# EAGLE design DensityAltitude (EAGLE 7.2.0)
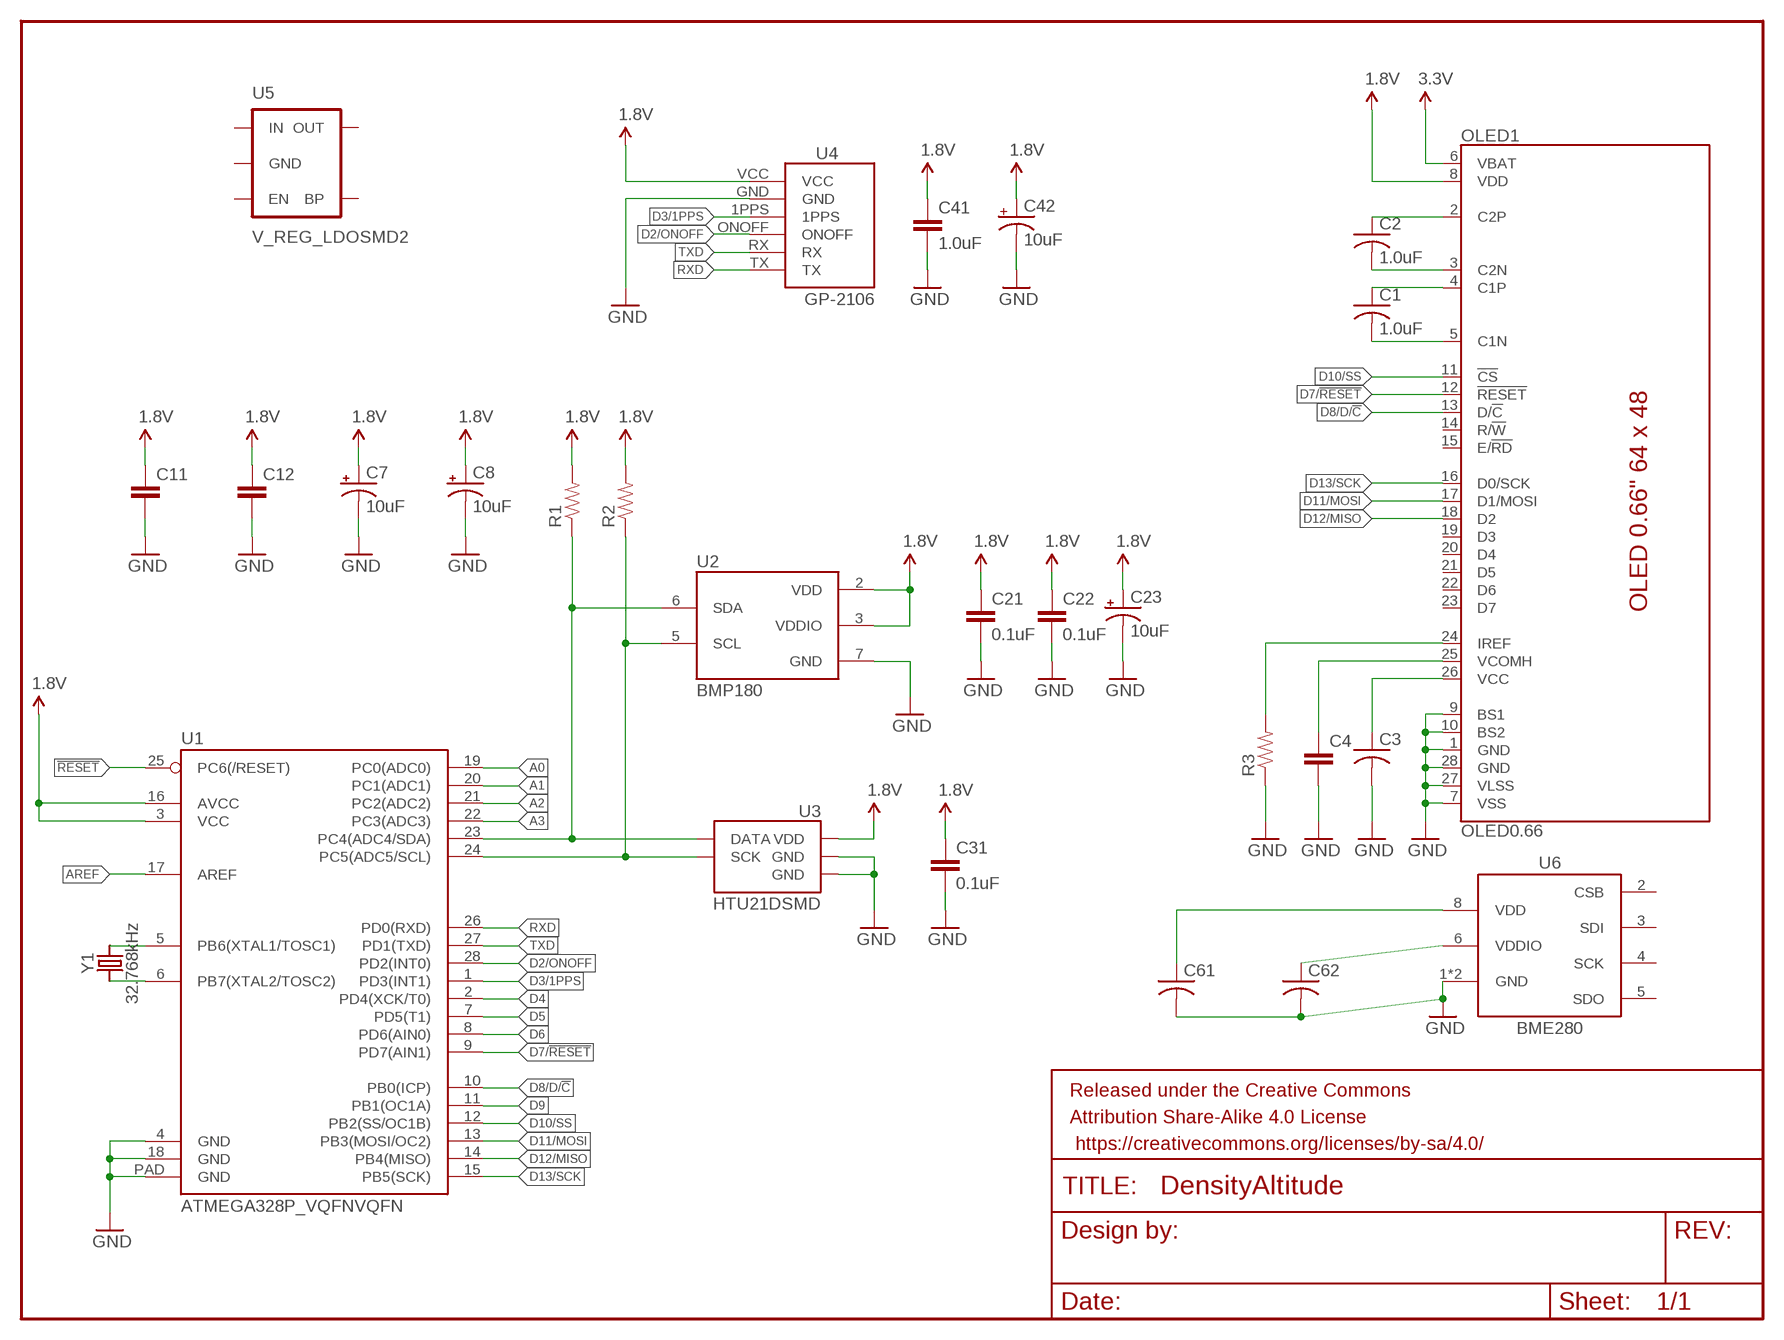
[diagram p0: schematic, sheet 1]

## Parts
C1  1.0uF  C-USC0201  [C0201]
C2  1.0uF  C-USC0201  [C0201]
C3  C-USC0201  [C0201]
C4  CAP0402-CAP  [0402-CAP]
C7  10uF  10UF-16V-10%(TANT)  [EIA3216]
C8  10uF  10UF-16V-10%(TANT)  [EIA3216]
C11  CAP0402-CAP  [0402-CAP]
C12  CAP0402-CAP  [0402-CAP]
C21  0.1uF  0.1UF-16V(+-10%)(0402)  [0402-CAP]
C22  0.1uF  0.1UF-16V(+-10%)(0402)  [0402-CAP]
C23  10uF  10UF-16V-10%(TANT)  [EIA3216]
C31  0.1uF  0.1UF-16V(+-10%)(0402)  [0402-CAP]
C41  1.0uF  1.0UF-16V-10%(0402)  [0402-CAP]
C42  10uF  10UF-16V-10%(TANT)  [EIA3216]
C61  C-USC0201  [C0201]
C62  C-USC0201  [C0201]
FRAME1  FRAME-LETTER  [CREATIVE_COMMONS]
OLED1  OLED0.66  [OLED-0.66-64X48]
R1  RESISTOR0402-RES  [0402-RES]
R2  RESISTOR0402-RES  [0402-RES]
R3  RESISTOR0402-RES  [0402-RES]
U1  ATMEGA328P_VQFNVQFN  [VQFN-28]
U2  BMP180  [BMP180]
U3  HTU21DSMD  [HTU21D]
U4  GP-2106  [GP-2106]
U5  V_REG_LDOSMD2  [SC70]
U6  BME280  [BME280]
Y1  32.768kHz  FX12232.768KHZ  [2-SMD]

## Nets
1.8V: C7.A(+) C8.A(+) C11.1 C12.1 C21.1 C22.1 C23.A(+) C31.1 C41.1 C42.A(+) OLED1.8(VDD) R1.2 R2.2 U1.3(VCC) U1.16(AVCC) U2.2(VDD) U2.3(VDDIO) U3.VDD U4.VCC
3.3V: OLED1.6(VBAT)
!RESET: U1.25(PC6(/RESET))
A0: U1.19(PC0(ADC0))
A1: U1.20(PC1(ADC1))
A2: U1.21(PC2(ADC2))
A3: U1.22(PC3(ADC3))
A4/SDA: R1.1 U1.23(PC4(ADC4/SDA)) U2.6(SDA) U3.DATA
A5/SCL: R2.1 U1.24(PC5(ADC5/SCL)) U2.5(SCL) U3.SCK
AREF: U1.17(AREF)
D2/ONOFF: U1.28(PD2(INT0)) U4.ONOFF
D3/1PPS: U1.1(PD3(INT1)) U4.1PPS
D4: U1.2(PD4(XCK/T0))
D5: U1.7(PD5(T1))
D6: U1.8(PD6(AIN0))
D7/!RESET: OLED1.12(!RESET!) U1.9(PD7(AIN1))
D8/D/!C: OLED1.13(D/!C!) U1.10(PB0(ICP))
D9: U1.11(PB1(OC1A))
D10/SS: OLED1.11(!CS!) U1.12(PB2(SS/OC1B))
D11/MOSI: OLED1.17(D1/MOSI) U1.13(PB3(MOSI/OC2))
D12/MISO: OLED1.18(D2) U1.14(PB4(MISO))
D13/SCK: OLED1.16(D0/SCK) U1.15(PB5(SCK))
GND: C3.2 C4.2 C7.C(-) C8.C(-) C11.2 C12.2 C21.2 C22.2 C23.C(-) C31.2 C41.2 C42.C(-) C61.2 C62.2 OLED1.1(GND) OLED1.7(VSS) OLED1.9(BS1) OLED1.10(BS2) OLED1.27(VLSS) OLED1.28(GND) R3.1 U1.4(GND) U1.18(GND) U1.PAD(GND) U2.7(GND) U3.7(GND) U3.GND U4.GND U6.1(GND) U6.7(GND)
N$1: C62.1 U6.6(VDDIO)
N$3: C61.1 U6.8(VDD)
N$4: U1.5(PB6(XTAL1/TOSC1)) Y1.2
N$5: U1.6(PB7(XTAL2/TOSC2)) Y1.1
N$13: C2.1 OLED1.2(C2P)
N$14: C2.2 OLED1.3(C2N)
N$15: C1.1 OLED1.4(C1P)
N$16: C1.2 OLED1.5(C1N)
N$17: C3.1 OLED1.26(VCC)
N$18: C4.1 OLED1.25(VCOMH)
N$19: OLED1.24(IREF) R3.2
RXD: U1.26(PD0(RXD)) U4.TX
TXD: U1.27(PD1(TXD)) U4.RX
Unconnected: OLED1.14(R/!W!) OLED1.15(E/!RD!) OLED1.19(D3) OLED1.20(D4) OLED1.21(D5) OLED1.22(D6) OLED1.23(D7) U5.1(IN) U5.2(GND) U5.3(EN) U5.4(BP) U5.5(OUT) U6.2(CSB) U6.3(SDI) U6.4(SCK) U6.5(SDO)

## Library data of the parts
C1-C3 C61 C62 = rcl:C-US: CAPACITOR, American symbol
C4 C11 C12 = SparkFun-Passives:CAP: Capacitor Standard 0603 ceramic capacitor, and 0.1" leaded capacitor.
C7 C8 C23 C42 = SparkFun-Capacitors:10UF-16V-10%(TANT): CAP-00811 1206/EIA-3216 Tantalum capacitor; PROD_ID: CAP-00811
C21 C22 C31 = SparkFun-Capacitors:0.1UF-16V(+-10%)(0402); PROD_ID: CAP-12416
C41 = SparkFun-Capacitors:1.0UF-16V-10%(0402); PROD_ID: CAP-12417
FRAME1 = SparkFun-Aesthetics:FRAME-LETTER: Schematic Frame Standard 8.5x11 US Letter frame; DESIGNER: NAME; VERSION: v01
OLED1 = SparkFun-Displays:OLED0.66
R1-R3 = SparkFun-Passives:RESISTOR: Resistor Basic schematic elements and footprints for 0603, 1206, and PTH resistors.
U1 = SparkFun-DigitalIC:ATMEGA328P_VQFN
U2 = SparkFun-Sensors:BMP180: BOSCH BMP180 DIGITAL BAROMETRIC PRESSURE SENSOR Web page: http://www.bosch-sensortec.com/en/homepage/products_3/environmental_sensors_1/bmp180_1/bmp180 Datasheet: http://ae-bst.resource.bosch.com/media/products/dokumente/bmp180/BST-BMP180-DS000-09.pdf The BMP180 is the function compatible successor of the BMP085, a new generation of high precision digital pressure sensors for consumer applications. The ultra-low power, low voltage electronics of the BMP180 is optimized for use in mobile phones, PDAs, GPS navigation devices and outdoor equipment. With a low altitude noise of merely 0.25m at fast conversion time, the BMP180 offers superior performance. The I2C interface allows for easy system integration with a microcontroller. The BMP180 is based on piezo-resistive technology for EMC robustness, high accuracy and linearity as well as long term stability. Key features: - Temperature measurement included - I2C interface - Fully calibrated - Pb-free, halogen-free and RoHS compliant, - MSL 1 Basic specs: Pressure range: 300 to 1100hPa (+9000m to -500m relating to sea level) Supply voltage: 1.8 to 3.6V (VDD), 1.62V to 3.6V (VDDIO) Package: LGA package with metal lid Small footprint: 3.6mm x 3.8mm Super-flat: 0.93mm height Low power: 5μA at 1 sample / sec. in standard mode Low noise: 0.06hPa (0.5m) in ultra low power mode, 0.02hPa (0.17m) advanced resolution mode Typical applications: - Enhancement of GPS navigation (dead-reckoning, slope detection, etc.) - In- and out-door navigation - Leisure and sports - Weather forecast - Vertical velocity indication (rise/sink speed)
U3 = SparkFun-Sensors:HTU21D
U4 = SparkFun-RF:GP-2106: GP-2106 GPS SiRF IV
U5 = SparkFun-PowerIC:V_REG_LDO: Voltage Regulator LDO Standard 150mA LDO voltage regulator in SOT-23 layout. Micrel part MIC5205. BP (by-pass) pin is used to lower output noise with 470pF cap.
U6 = DensityAltitude:BME280: BOSCH BME280 Combined humidity and pressure sensor Web page: http://www.bosch-sensortec.com/en/homepage/products_3/environmental_sensors_1/bme280/bme280_1 Datasheet: http://ae-bst.resource.bosch.com/media/products/dokumente/bme280/BST-BME280_DS001-09.pdf The BME280 is an integrated environmental sensor developed specifically for mobile applications where size and low power consumption are key design constraints. The unit combines individual high linearity, high accuracy sensors for pressure, humidity and temperature in an 8-pin metal-lid 2.5 x 2.5 x 0.93 mm3 LGA package, designed for low current consumption (3.6 μA @1Hz), long term stability and high EMC robustness. The humidity sensor features an extremely fast response time which supports performance requirements for emerging applications such as context awareness, and high accuracy over a wide temperature range. The pressure sensor is an absolute barometric pressure sensor with features exceptionally high accuracy and resolution at very low noise. The integrated temperature sensor has been optimized for very low noise and high resolution. It is primarily used for temperature compensation of the pressure and humidity sensors, and can also be used for estimating ambient temperature. The BME280 supports a full suite of operating modes which provides the flexibility to optimize the device for power consumption, resolution and filter performance. Key features: - Temperature measurement included - I2C and SPI interfaces - Fully calibrated - Pb-free, halogen-free and RoHS compliant, - MSL 1 Basic specs: Pressure range: 300 to 1100hPa (+9000m to -500m relating to sea level) Supply voltage: 1.71 to 3.6V (VDD), 1.2V to 3.6V (VDDIO) Package: LGA package with metal lid Small footprint: 2.5mm x 2.5mm Super-flat: 0.93mm height Low power: 3.6μA at 1 sample / sec. in standard mode (humidity, pressure and temperature) Low noise: 0.06hPa (0.5m) in ultra low power mode, 0.02hPa (0.17m) advanced resolution mode Typical applications: - Context awareness, e.g. skin detection, room change detection - Health monitoring / well-being • Warning regarding dehydration or heat stroke • Measurement of lung volume and air flow - Home automation control • Control heating, ventilation, air conditioning (HVAC) - Internet of things - GPS enhancement (e.g. time-to-first-fix improvement, dead reckoning, slope detection) - Indoor navigation (change of floor detection, elevator detection) - Outdoor navigation, leisure and sports applications - Weather forecast - Vertical velocity indication (rise/sink speed)
Y1 = fx122:FX122: FX122 - SMD 2.0 x 1.2 Tuning Fork Crystal Technical Specifications: Frequency: 32.768 kHz Frequency Tolerance @ 25ºC: ±20 PPM Frequency Stability Temperature Coefficient: -0.04 PPM / (ΔºC)^2 0.6mm Height Long Term Stability http://www.foxonline.com/pdfs/FX122.pdf; DIGIKEY: 631-1261-1-ND

## Board
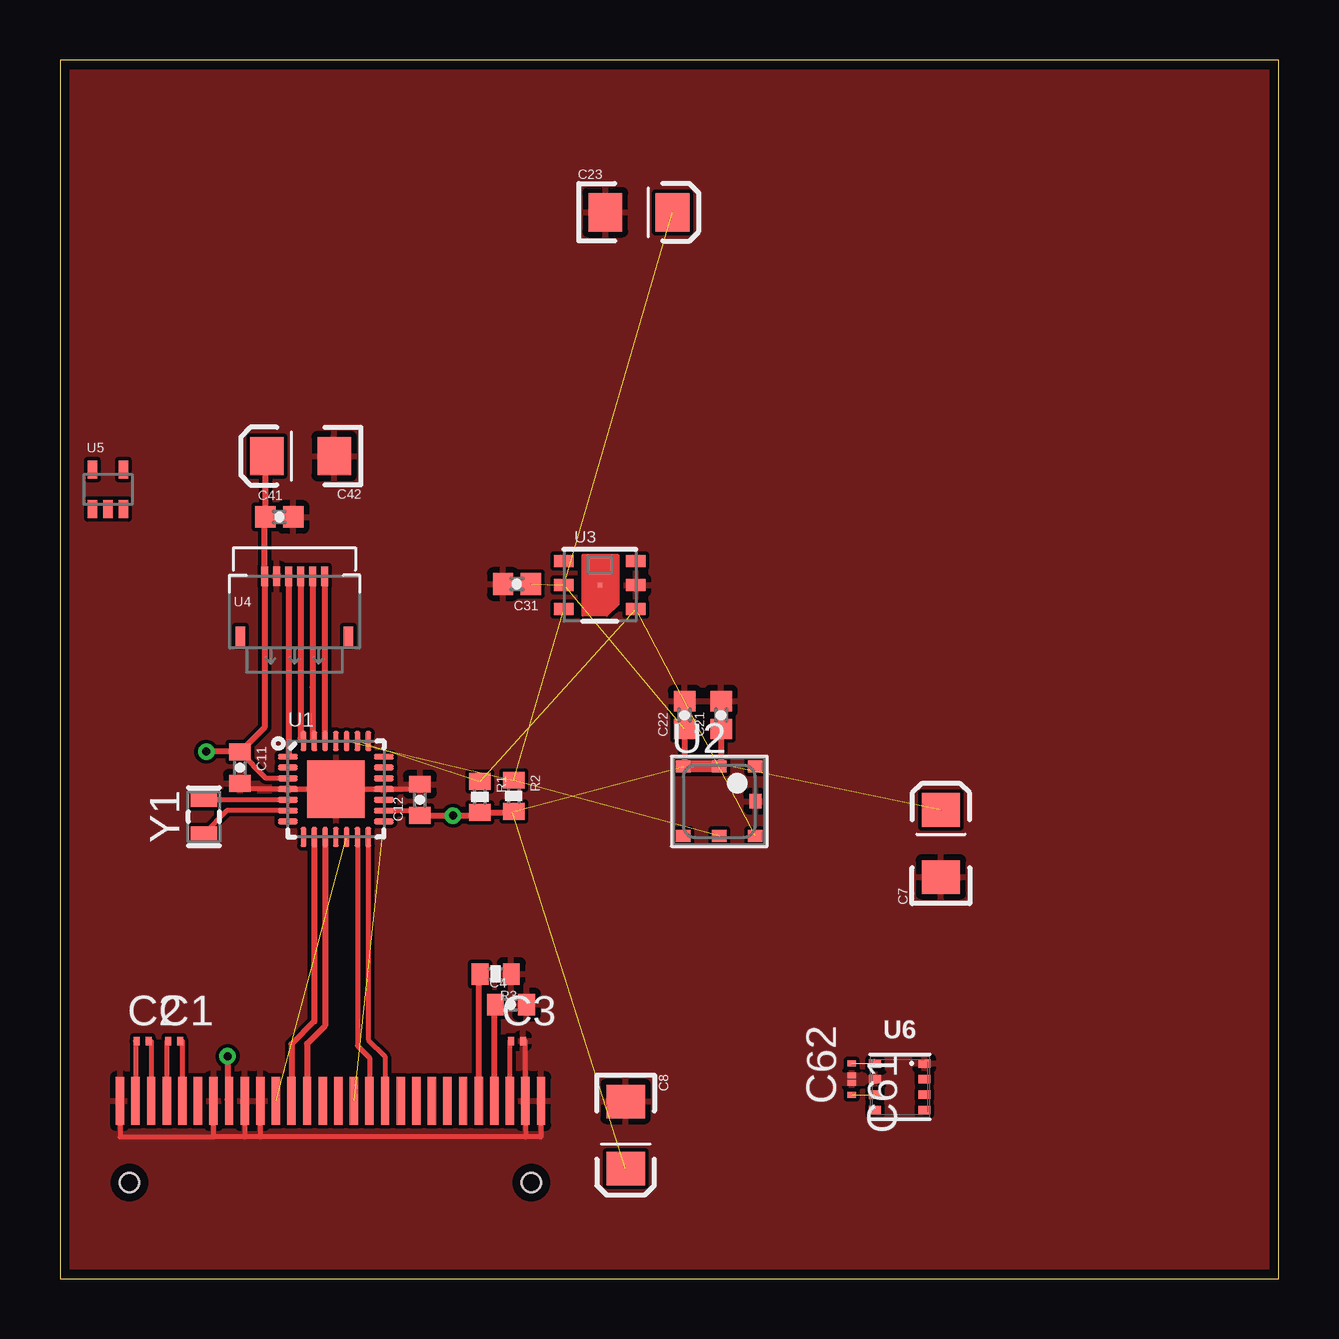
[diagram p1: board, top side]
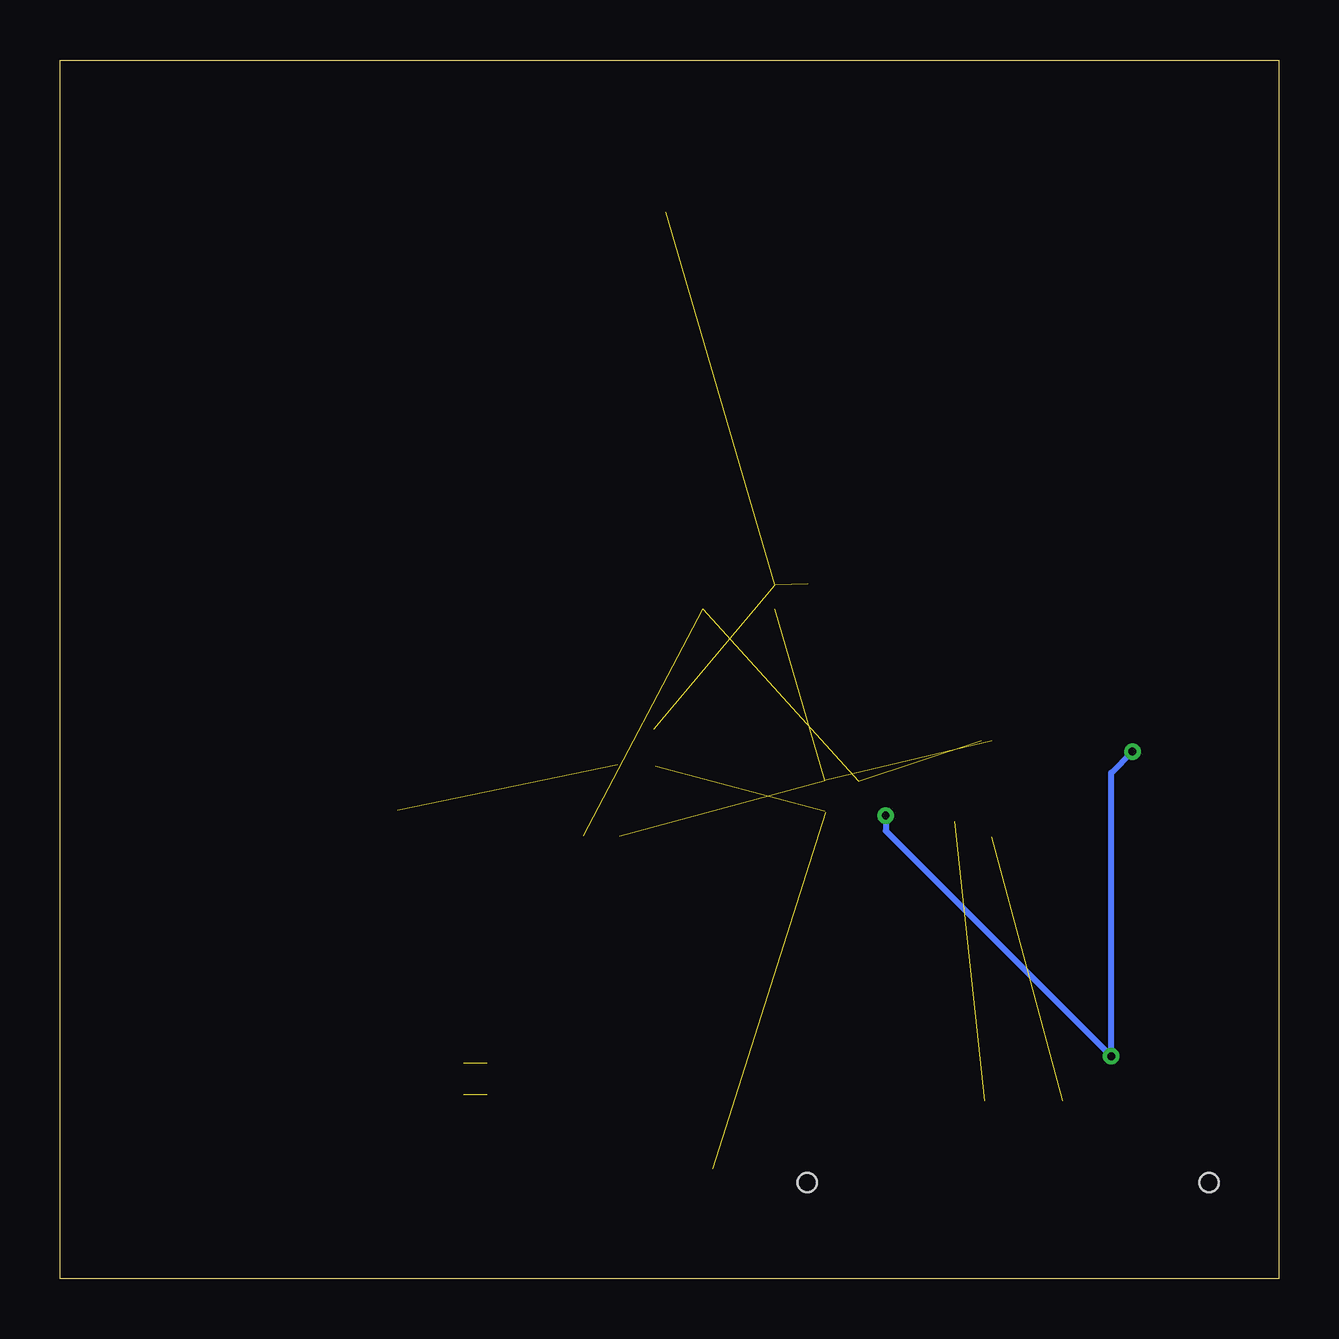
[diagram p2: board, bottom side, seen from below]

Size 50.8 x 50.8 mm. Coordinates in mm from the lower left corner, seen from the top.
Outline: 0,0 50.8,0 50.8,50.8 0,50.8 0,0
Copper layers (1*16): Top 0.0356mm / dielectric 1.5011mm / Bottom 0.0356mm
Design rules "oshpark-2layer": minimum track width 6mil, minimum drill 13mil, track to track 6mil, track to pad 6mil, pad to pad 6mil, via to via 6mil, smd to smd 6mil, copper to edge 15mil, drill to drill 6mil, minimum pad ring 7mil, minimum via ring 7mil, stop-mask expansion 4mil, vias tented up to drill 0mil, thermal gap 10mil

### Footprints (pad centres in the part's own frame; a part is rotated, then mirrored left to right if it is on the bottom)
C0201 = smd 0.25 x 0.35: 1 -0.25,0; 2 0.25,0
0402-CAP = smd 0.7 x 0.9: 1 -0.65,0; 2 0.65,0
EIA3216 = smd 1.4 x 1.6: A 1.4,0; C -1.4,0
0402-CAP' = smd 0.85 x 0.9: 1 -0.58,0; 2 0.58,0
OLED-0.66-64X48 = smd 0.35 x 2: 1 0,0; 2 0.65,0; 3 1.3,0; 4 1.95,0; 5 2.6,0; 6 3.25,0; 7 3.9,0; 8 4.55,0; 9 5.2,0; 10 5.85,0; 11 6.5,0; 12 7.15,0; 13 7.8,0; 14 8.45,0; 15 9.1,0; 16 9.75,0; 17 10.4,0; 18 11.05,0; 19 11.7,0; 20 12.35,0; 21 13,0; 22 13.65,0; 23 14.3,0; 24 14.95,0; 25 15.6,0; 26 16.25,0; 27 16.9,0; 28 17.55,0 | hole 0.8: 17.15,-3.4; 0.4,-3.4
0402-RES = smd 0.7 x 0.9: 1 -0.65,0; 2 0.65,0
VQFN-28 = smd 0.82 x 0.24: 1 -2,1.35; 2 -2,0.9; 3 -2,0.45; 4 -2,0; 5 -2,-0.45; 6 -2,-0.9; 7 -2,-1.35; 15 2,-1.35; 16 2,-0.9; 17 2,-0.45; 18 2,0; 19 2,0.45; 20 2,0.9; 21 2,1.35 | smd 0.24 x 0.82: 8 -1.35,-2; 9 -0.9,-2; 10 -0.45,-2; 11 0,-2; 12 0.45,-2; 13 0.9,-2; 14 1.35,-2; 22 1.35,2; 23 0.9,2; 24 0.45,2; 25 0,2; 26 -0.45,2; 27 -0.9,2; 28 -1.35,2 | smd 2.4 x 2.4: PAD 0,0
BMP180 = smd 0.6 x 0.5: 1 1.5,1.45; 2 0,1.45; 3 -1.5,1.45; 4 -1.5,-1.45; 5 0,-1.45; 6 1.5,-1.45 | smd 0.5 x 0.6: 7 1.5,0
HTU21D = smd 0.2 x 0.2: 7 0,0 | smd 0.8 x 0.5: DATA 1.5,-1; GND 1.5,0; NC@1 -1.5,1; NC@6 1.5,1; SCK -1.5,-1; VDD -1.5,0
GP-2106 = smd 0.3 x 0.8: 1PPS -0.25,0; GND -0.75,0; ONOFF 0.25,0; RX 0.75,0; TX 1.25,0; VCC -1.25,0 | smd 0.4 x 0.8: P$7 -2.25,-2.5; P$8 2.25,-2.5
SC70 = smd 0.4 x 0.75: 1 -0.65,-0.825; 2 0,-0.825; 3 0.65,-0.825; 4 0.65,0.825; 5 -0.65,0.825
BME280 = smd 0.5 x 0.35: 1 1.025,0.975; 2 1.025,0.325; 3 1.025,-0.325; 4 1.025,-0.975; 5 -1.025,-0.975; 6 -1.025,-0.325; 7 -1.025,0.325; 8 -1.025,0.975
2-SMD = smd 0.6 x 1.1: 1 -0.7,0; 2 0.7,0

### Placement (x,y rotation side)
C1  4.75,9.91 0 top
C2  3.45,9.91 0 top
C3  19.05,9.91 0 top
C4  18.8,11.43 0 top
C7  36.72,18.14 90 top
C8  23.58,5.99 270 top
C11  7.5,21.3 270 top
C12  15,19.96 90 top
C21  0.1uF  [0402-CAP']  27.56,23.5 90 top
C22  0.1uF  [0402-CAP']  26.04,23.5 90 top
C23  24.13,44.45 0 top
C31  0.1uF  [0402-CAP']  19.05,28.96 180 top
C41  1.0uF  [0402-CAP']  9.14,31.75 0 top
C42  10.03,34.29 180 top
C61  33,8.72 270 top
C62  33,7.92 90 top
FRAME1  21.59,-8.89 0 top  (outside the outline)
OLED1  2.5,7.41 0 top
R1  17.5,20.08 270 top
R2  18.91,20.13 270 top
R3  18.16,12.7 180 top
U1  11.5,20.41 0 top
U2  27.48,19.9 0 top
U3  22.5,28.91 0 top
U4  9.78,29.28 0 top
U5  2,32.91 0 top
U6  35,8 0 top
Y1  6,19.26 90 top

### Tracks (layer width: path | path; a pad name or v marks a point on that pad's centre or on a via)
1.8V  (via drill 0.33)  (6 unrouted)
  Top 0.203: U1.16 14.85,19.51 C12.1 | U1.3 8.59,20.86 C11.1
  Top 0.254: v6.1,21.97 7.48,21.97 C11.1 8.53,22.98 U4.VCC 8.53,31.71 C41.1 8.56,34.22 C42.A | v6.99,9.27 6.99,7.47 OLED1.8 | C12.1 v16.38,19.31 v16.38,19.3 17.37,19.3 R1.2 18.86,19.43 R2.2 | C21.1 27.56,21.43 U2.2 | C22.1 26.04,21.41 U2.3
  Top 0.5: U2.2 U2.3
  Bottom 0.254: v6.1,21.97 6.99,21.08 v6.99,9.27 16.38,18.67 v16.38,19.3
A4/SDA  (3 unrouted)
A5/SCL  (3 unrouted)
D2/ONOFF
  Top 0.254: U4.ONOFF 10.03,22.53 U1.28
D3/1PPS
  Top 0.254: U4.1PPS 9.53,21.79 U1.1
D7/!RESET
  Top 0.254: U1.9 10.6,10.73 9.65,9.78 OLED1.12
D8/D/!C
  Top 0.254: U1.10 11.05,10.54 10.3,9.79 OLED1.13
D10/SS  (1 unrouted)
D11/MOSI
  Top 0.203: U1.13 12.4,9.71 12.9,9.21 OLED1.17
D12/MISO
  Top 0.203: U1.14 12.85,9.96 13.55,9.26 OLED1.18
D13/SCK  (1 unrouted)
GND
  Top 0.203: OLED1.1 2.5,5.91 6.4,5.91 | 6.4,5.91 OLED1.7 | OLED1.9 7.7,5.91 | 7.7,5.91 6.4,5.91 | 19.4,5.91 OLED1.27 19.4,9.91 C3.2 | 19.4,5.91 8.35,5.91 | 8.35,5.91 7.7,5.91 | OLED1.10 8.35,5.91 | OLED1.28 20.05,5.91 19.4,5.91 | C12.2 14.75,20.41 U1.18 U1.PAD U1.4 7.53,20.41 C11.2
  pour Top: 0,0 50.8,0 50.8,50.8 0,50.8
  pour Top (isolate 0.305, no thermals): 35.4,8.6 31.8,8.6 31.8,8.1 35.4,8.1
N$1  (1 unrouted)
N$3  (1 unrouted)
N$4
  Top 0.203: U1.5 Y1.2
N$5
  Top 0.203: U1.6 6.95,19.51 Y1.1
N$13
  Top 0.203: C2.1 3.15,9.91 OLED1.2
N$14
  Top 0.203: C2.2 3.8,9.91 OLED1.3
N$15
  Top 0.203: C1.1 4.45,9.91 OLED1.4
N$16
  Top 0.203: C1.2 5.1,9.91 OLED1.5
N$17
  Top 0.203: OLED1.26 18.75,9.91 C3.1
N$18
  Top 0.254: C4.1 18.1,11.38 OLED1.25
N$19
  Top 0.254: R3.2 17.45,12.64 OLED1.24
RXD
  Top 0.254: U4.TX 11.03,22.43 U1.26
TXD
  Top 0.254: U4.RX 10.53,24.65 10.54,24.64 10.54,22.47 U1.27